# Altium schematic sheet +20_to_-14.schdoc
size A; SheetNumber: 3; SheetTotal: 5
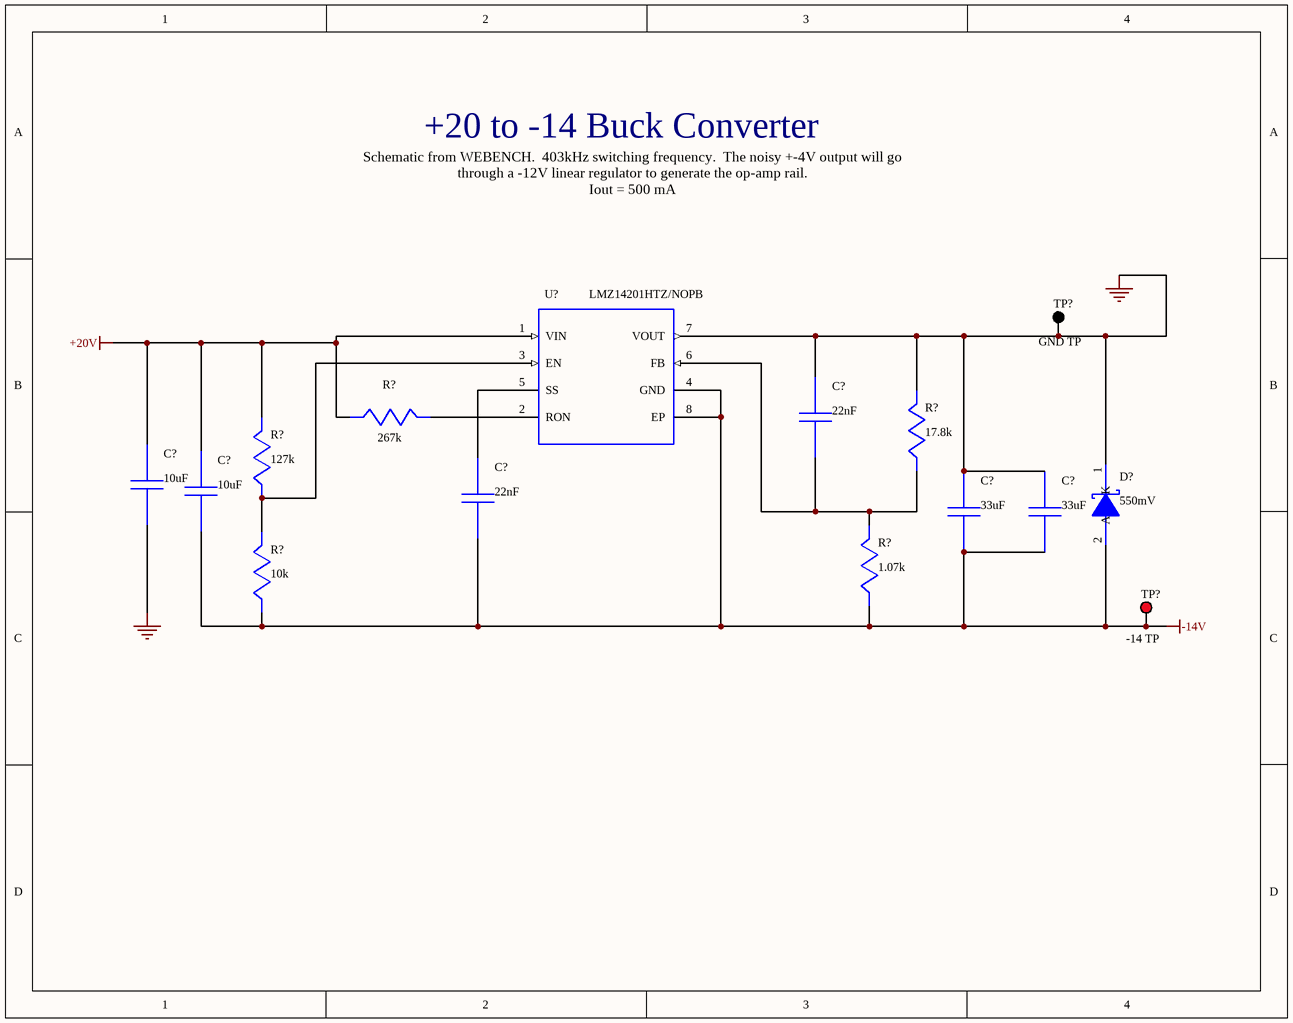
[diagram p0: +20_to_-14.schdoc]

## Parts
(Parts that share a designator on the sheet are numbered #1, #2 ... from top to bottom, then left to right.)
C?#1  value 22nF  (hidden comment: C0805C223K5RACTU)
C?#2  value 10uF  (hidden comment: C3216X5R1H106K160AB)
C?#3  value 10uF  (hidden comment: C5750X7R2E684M)
C?#4  value 22nF  (hidden comment: C0805C223K5RACTU)
C?#5  value 33uF  (hidden comment: C3216X5R1E336M160AC)
C?#6  value 33uF  (hidden comment: C3216X5R1E336M160AC)
D?  value 550mV  (hidden comment: SS14FL)
R?#1  value 267k  (hidden comment: ERJ-6ENF2673V)
R?#2  value 17.8k  (hidden comment: ERJ-6ENF1782V)
R?#3  value 127k  (hidden comment: CRCW0805127KFKEA)
R?#4  value 1.07k  (hidden comment: ERJ-6ENF1071V)
R?#5  value 10k  (hidden comment: CRCW080510K0FKEA)
TP?#1  GND TP  [KSTN-5011_V]
TP?#2  -14 TP  [KSTN-5010_V]
U?  LMZ14201HTZ/NOPB

## Nets
0: C?#1.1 C?#2.2 C?#5.1 C?#6.1 D?.1(K) R?#2.1 TP?#1.1 U?.7(VOUT)
+20V: C?#2.1 C?#3.1 R?#1.2 R?#3.1 U?.1(VIN)
-14V: C?#3.2 C?#4.2 C?#5.2 C?#6.2 D?.2(A) R?#4.2 R?#5.2 TP?#2.1 U?.4(GND) U?.8(EP)
NetC?#1_2: C?#1.2 R?#2.2 R?#4.1 U?.6(FB)
NetC?#4_1: C?#4.1 U?.5(SS)
NetR?#1_1: R?#1.1 U?.2(RON)
NetR?#3_2: R?#3.2 R?#5.1 U?.3(EN)

## Notes on the sheet
- +20 to -14 Buck Converter
- Schematic from WEBENCH.  403kHz switching frequency.  The noisy +-4V output will go through a -12V linear regulator to generate the op-amp rail.
  Iout = 500 mA

## Library data of the parts
C?#1 C?#4 = C0805C223K5RACTU: Manufacturer Name: Kemet; PackageReference: C0805C223K5RACTU; Manufacturer Part Number: C0805C223K5RACTU
C?#2 = C3216X5R1H106K160AB: C3216X5R1H106K16; Manufacturer Name: TDK; PackageReference: C3216X5R1H106K160AB; Manufacturer Part Number: C3216X5R1H106K160AB
C?#3 = C5750X7R2E684M: C5750X7S2A106M23; Manufacturer Name: TDK; PackageReference: C5750X7S2A106M230KB; Manufacturer Part Number: C5750X7R2E684M
C?#5 C?#6 = C3216X5R1E336M160AC: C3216X5R1E336M16; Manufacturer Name: TDK; PackageReference: C3216X5R1E336M160AC; Manufacturer Part Number: C3216X5R1E336M160AC
D? = SS14FL: Manufacturer Name: Fairchild Semiconductor; PackageReference: SS14FL; Manufacturer Part Number: SS14FL
R?#1 = ERJ-6ENF2673V: Manufacturer Name: Panasonic; PackageReference: ERJ-6ENF2673V; Manufacturer Part Number: ERJ-6ENF2673V
R?#2 = ERJ-6ENF1782V: Manufacturer Name: Panasonic; PackageReference: ERJ-6ENF1782V; Manufacturer Part Number: ERJ-6ENF1782V
R?#3 = CRCW0805127KFKEA: Manufacturer Name: Vishay-Dale; PackageReference: CRCW0805127KFKEA; Manufacturer Part Number: CRCW0805127KFKEA
R?#4 = ERJ-6ENF1071V: Manufacturer Name: Panasonic; PackageReference: ERJ-6ENF1071V; Manufacturer Part Number: ERJ-6ENF1071V
R?#5 = CRCW080510K0FKEA: Manufacturer Name: Vishay-Dale; PackageReference: CRCW080510K0FKEA; Manufacturer Part Number: CRCW080510K0FKEA
TP?#1 = CMP-1672-00003-4: Test Point, Black, Through Hole, RoHS, Bulk; Manufacturer: Keystone; ComponentLink2URL: http://www.keyelco.com/product-pdf.cfm?p=1320; Colour: Black; Pins: 1; REACH SVHC: No SVHC; ComponentLink1URL: http://www.keyelco.com/; PackageReference: 5011; Contact Plating: Silver; Package Quantity: 100; Packaging: Bulk; RoHSCompliant: true; Height: 8.12 mm; PackageDescription: 1-Pin Through Hole Device, Dia 3.17 mm; Mount: Through Hole; Mounting Technology: Through Hole; DatasheetVersion: Rev. F, 12/2013; ComponentLink1Description: Manufacturer URL; Contact Material: Bronze; ComponentLink2Description: Datasheet
TP?#2 = CMP-1672-00002-4: Test Point, Red, Through Hole, RoHS, Bulk; Manufacturer: Keystone; Contact Material: Bronze; Mounting Technology: Through Hole; RoHSCompliant: true; Pins: 1; Package Quantity: 100; ComponentLink2Description: Datasheet; Height: 8.12 mm; ComponentLink1URL: http://www.keyelco.com/; DatasheetVersion: Rev. F, 12/2013; Mount: Through Hole; PackageReference: 5010; Contact Plating: Silver; Packaging: Bulk; Colour: Red; REACH SVHC: No SVHC; PackageDescription: 1-Pin Through Hole Device, Dia 3.17 mm; ComponentLink2URL: http://www.keyelco.com/product-pdf.cfm?p=1319; ComponentLink1Description: Manufacturer URL
U? = LMZ14201HTZ/NOPB: Manufacturer Name: Texas Instruments; PackageReference: LMZ14201HTZ/NOPB; Manufacturer Part Number: LMZ14201HTZ/NOPB; Value: N/A